# EAGLE design PowerConversionBoard (EAGLE 9.6.2)
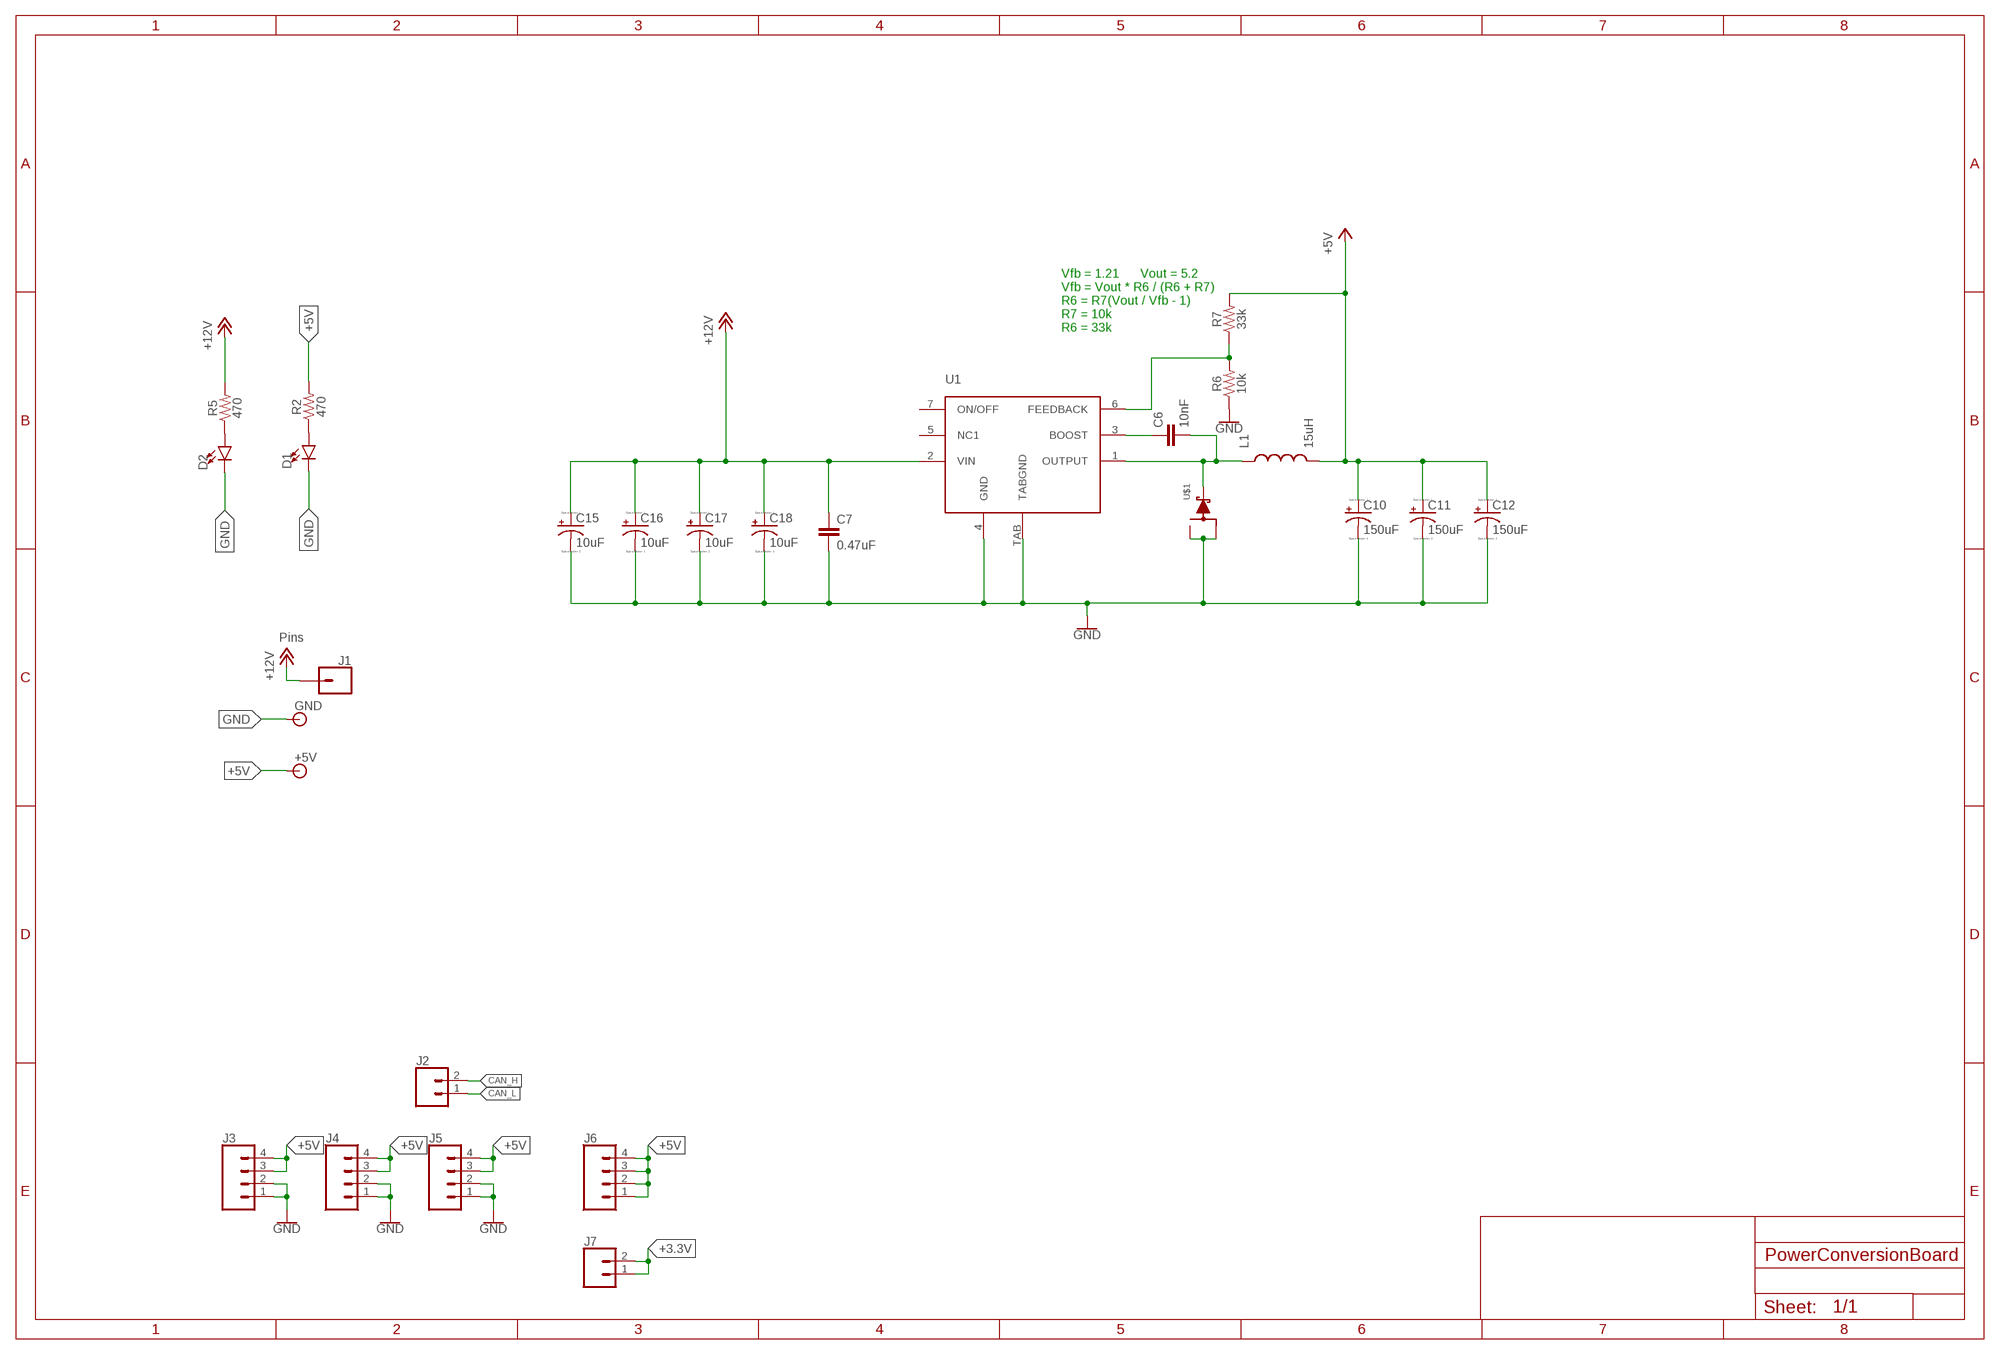
[diagram p0: schematic, sheet 1, part 1 of 3]
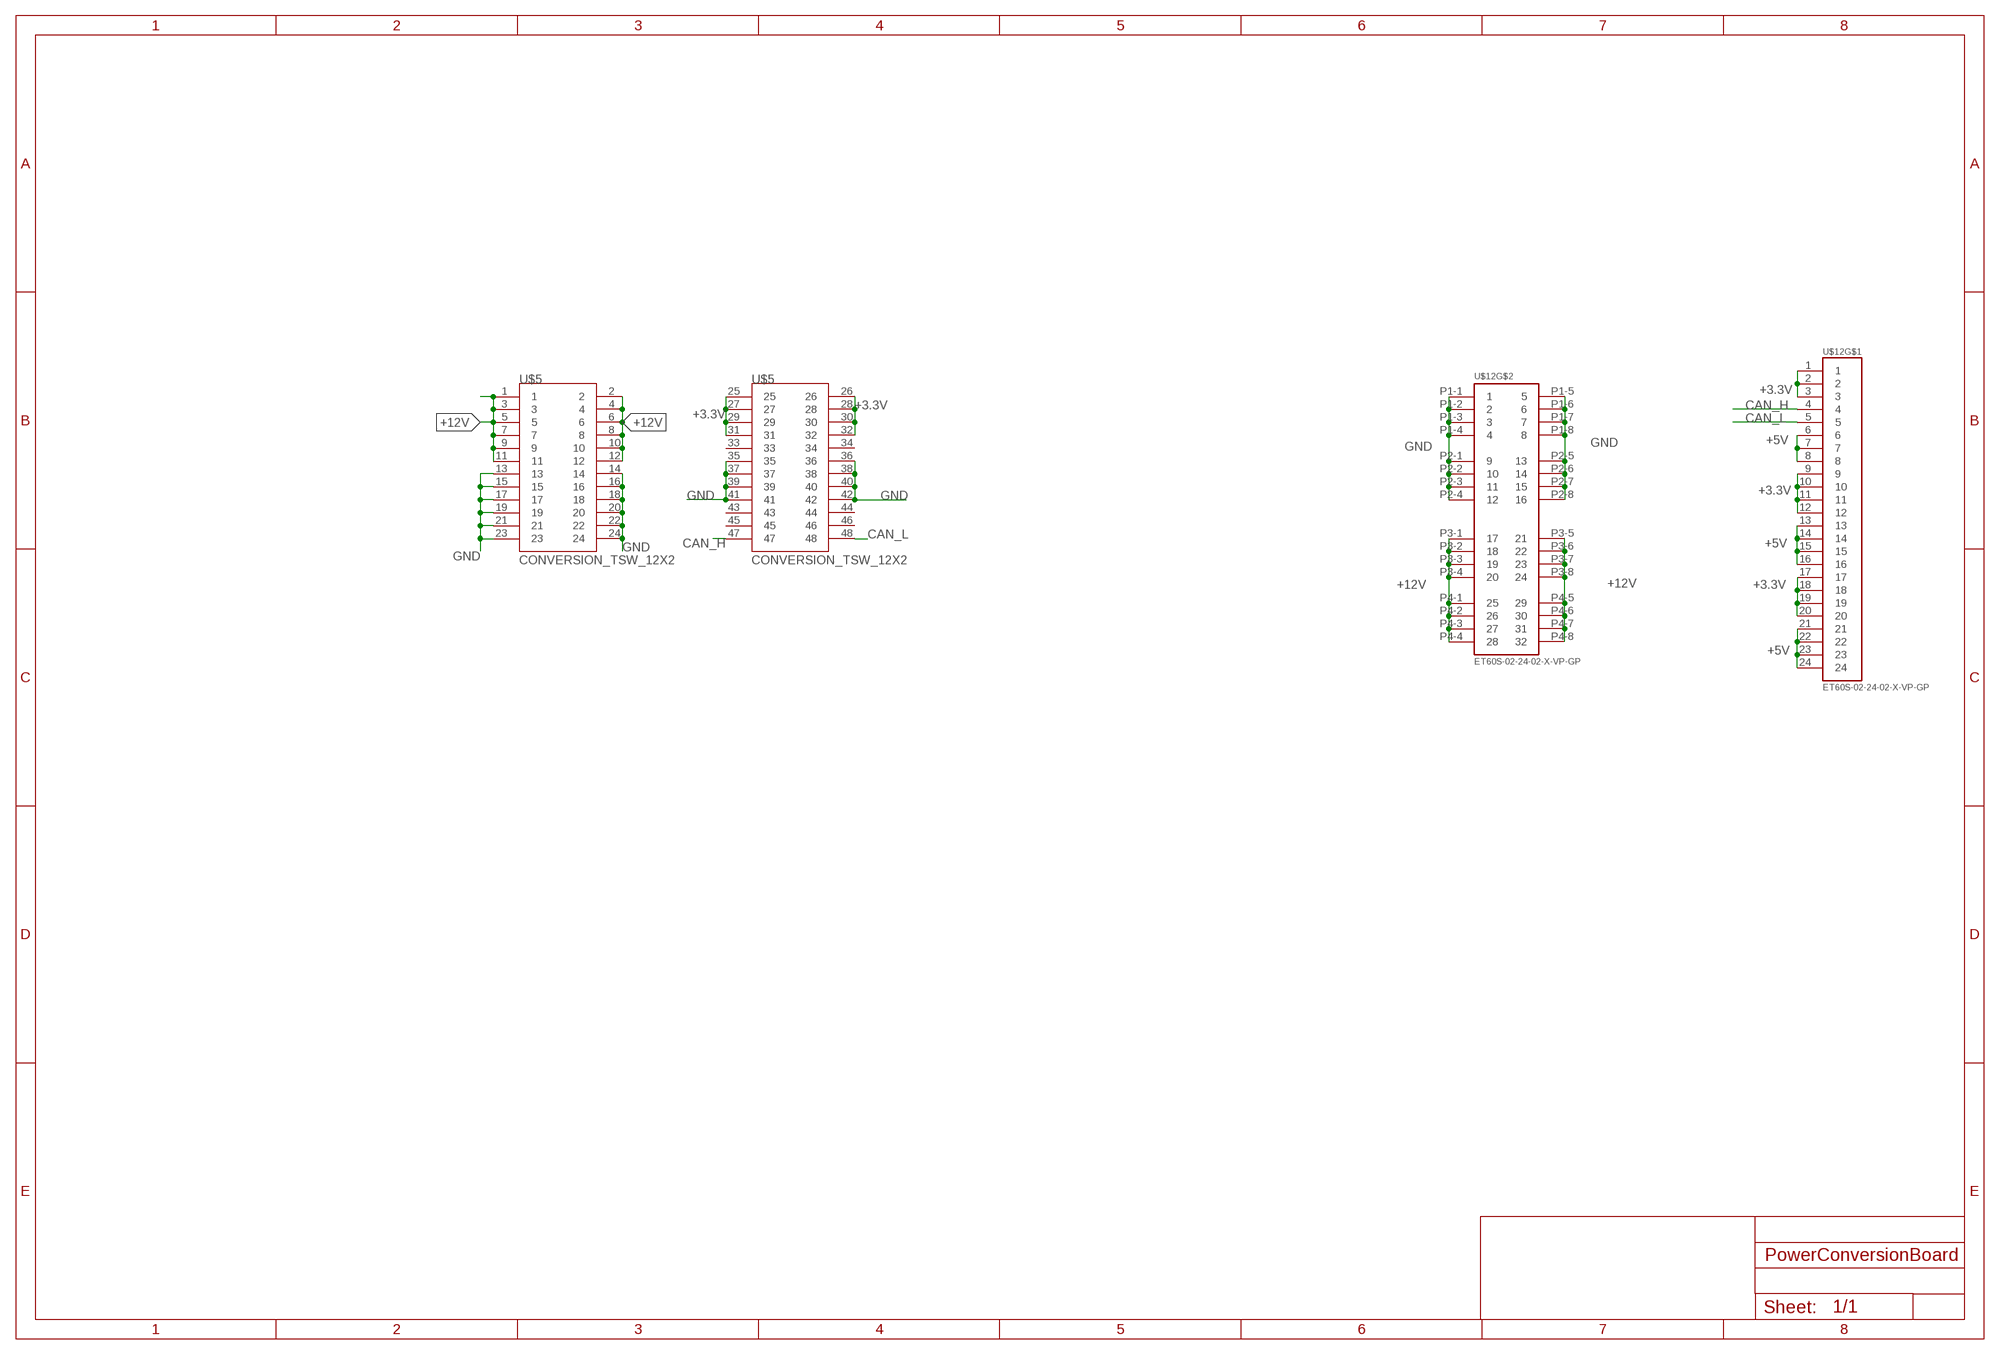
[diagram p1: schematic, sheet 1, part 2 of 3]
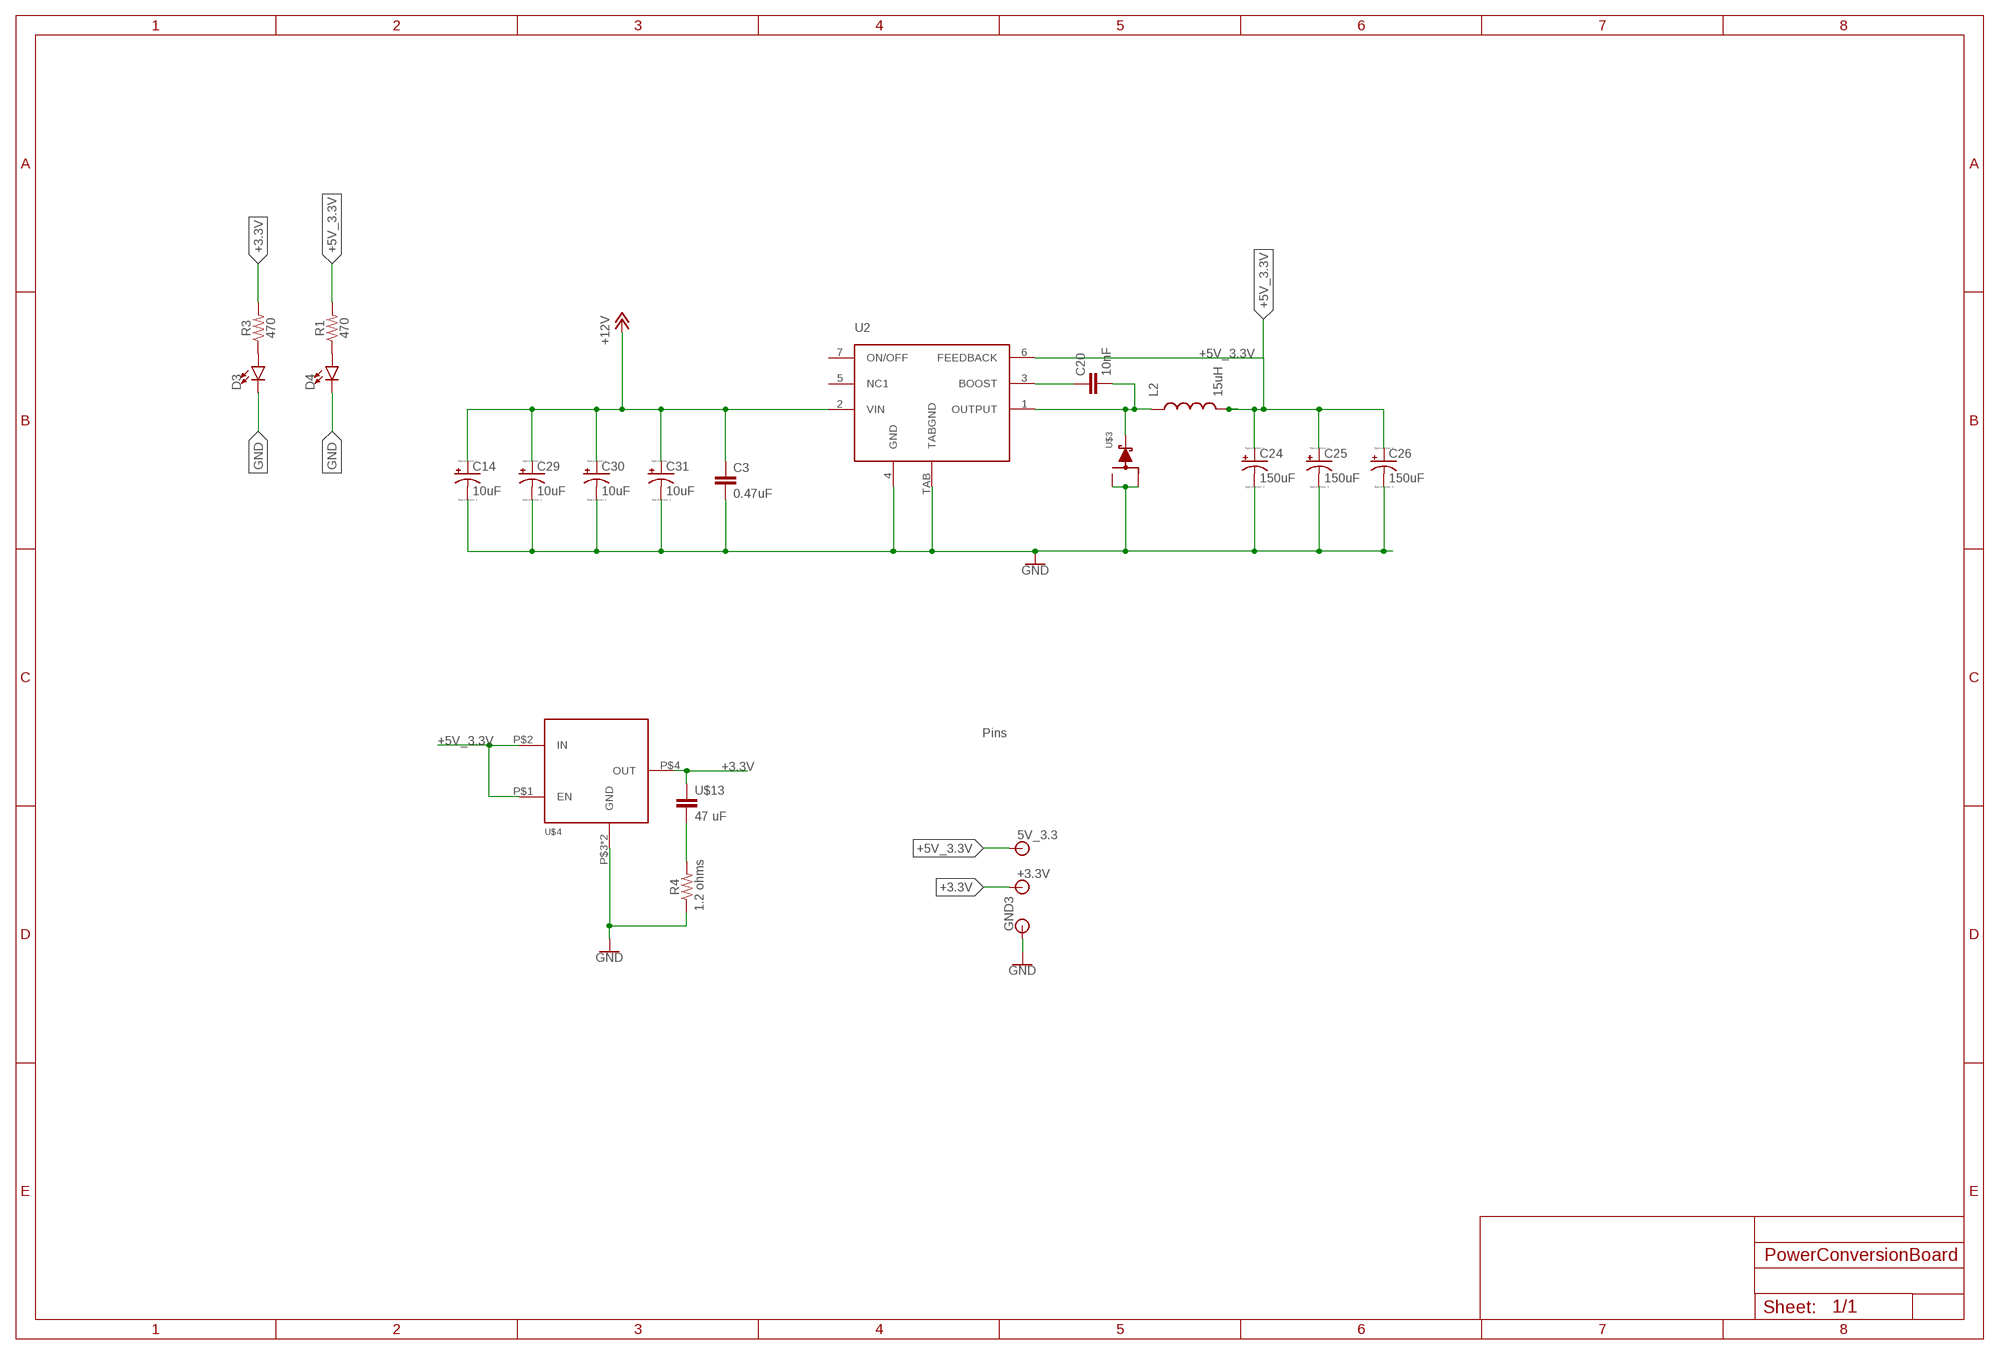
[diagram p2: schematic, sheet 1, part 3 of 3]

## Parts
5V_3.3  BANANA_CONN  [BANANA_CONN]
+3.3V  BANANA_CONN  [BANANA_CONN]
+5V  BANANA_CONN  [BANANA_CONN]
C3  0.47uF  C-EUC0603  [C0603]
C6  10nF  10NF-0603-50V-10%  [0603]
C7  0.47uF  C-EUC0603  [C0603]
C10  150uF  C-TANTALUM(10UF_150UF)  [CTAN(7.30_4.30MM)]
C11  150uF  C-TANTALUM(10UF_150UF)  [CTAN(7.30_4.30MM)]
C12  150uF  C-TANTALUM(10UF_150UF)  [CTAN(7.30_4.30MM)]
C14  10uF  C-TANTALUM(10UF_150UF)  [CTAN(7.30_4.30MM)]
C15  10uF  C-TANTALUM(10UF_150UF)  [CTAN(7.30_4.30MM)]
C16  10uF  C-TANTALUM(10UF_150UF)  [CTAN(7.30_4.30MM)]
C17  10uF  C-TANTALUM(10UF_150UF)  [CTAN(7.30_4.30MM)]
C18  10uF  C-TANTALUM(10UF_150UF)  [CTAN(7.30_4.30MM)]
C20  10nF  10NF-0603-50V-10%  [0603]
C24  150uF  C-TANTALUM(10UF_150UF)  [CTAN(7.30_4.30MM)]
C25  150uF  C-TANTALUM(10UF_150UF)  [CTAN(7.30_4.30MM)]
C26  150uF  C-TANTALUM(10UF_150UF)  [CTAN(7.30_4.30MM)]
C29  10uF  C-TANTALUM(10UF_150UF)  [CTAN(7.30_4.30MM)]
C30  10uF  C-TANTALUM(10UF_150UF)  [CTAN(7.30_4.30MM)]
C31  10uF  C-TANTALUM(10UF_150UF)  [CTAN(7.30_4.30MM)]
D1  LED0603  [LED-0603]
D2  LED0603  [LED-0603]
D3  LED0603  [LED-0603]
D4  LED0603  [LED-0603]
GND  BANANA_CONN  [BANANA_CONN]
GND3  BANANA_CONN  [BANANA_CONN]
J1  CONN_01  [1X01]
J2  CONN_02  [1X02]
J3  CONN_04  [1X04]
J4  CONN_04  [1X04]
J5  CONN_04  [1X04]
J6  CONN_04  [1X04]
J7  CONN_02  [1X02]
L1  15uH  HCMA1305  [HCMA1305]
L2  15uH  HCMA1305  [HCMA1305]
R1  470  470OHM-0603-1/10W-1%  [0603]
R2  470  470OHM-0603-1/10W-1%  [0603]
R3  470  470OHM-0603-1/10W-1%  [0603]
R4  1.2 ohms  RESISTOR0603  [0603]
R5  470  470OHM-0603-1/10W-1%  [0603]
R6  10k  10KOHM-0603-1/10W-1%  [0603]
R7  33k  33KOHM-0603-1/10W-1%  [0603]
U1  LM2678  [LM2678]
U2  LM2678  [LM2678]
U$1  SWITCHMODE_SCHOTTKY  [DPAK-3]
U$3  SWITCHMODE_SCHOTTKY  [DPAK-3]
U$4  TO-263  [TO-263]
U$5  CONVERSION_TSW_12X2  [CONVERSION_TSW_12X2]
U$12  ET60S-02-24-02-X-VP-GP  [ET60S-02-24-02-X-VP-GP]
U$13  47 uF  CAPACITOR_0603_N  [RESC0603_N]

## Nets
+3.3V: +3.3V.P$1 J7.1 J7.2 R3.2 U$4.P$4(OUT) U$5.25 U$5.26 U$5.27 U$5.28 U$5.29 U$5.30 U$5.31 U$5.32 U$12.1 U$12.2 U$12.3 U$12.9 U$12.10 U$12.11 U$12.12 U$12.17 U$12.18 U$12.19 U$12.20 U$13.1
+5V: +5V.P$1 C10.+ C11.+ C12.+ J3.3 J3.4 J4.3 J4.4 J5.3 J5.4 J6.1 J6.2 J6.3 J6.4 L1.2 R2.2 R7.2 U$12.6 U$12.7 U$12.8 U$12.13 U$12.14 U$12.15 U$12.16 U$12.21 U$12.22 U$12.23 U$12.24
+5V_3.3V: 5V_3.3.P$1 C24.+ C25.+ C26.+ L2.2 R1.2 U2.6(FEEDBACK) U$4.P$1(EN) U$4.P$2(IN)
+12V: C3.1 C7.1 C14.+ C15.+ C16.+ C17.+ C18.+ C29.+ C30.+ C31.+ J1.1 R5.2 U1.2(VIN) U2.2(VIN) U$5.1 U$5.2 U$5.3 U$5.4 U$5.5 U$5.6 U$5.7 U$5.8 U$5.9 U$5.10 U$5.11 U$5.12 U$12.P3-1 U$12.P3-2 U$12.P3-3 U$12.P3-4 U$12.P3-5 U$12.P3-6 U$12.P3-7 U$12.P3-8 U$12.P4-1 U$12.P4-2 U$12.P4-3 U$12.P4-4 U$12.P4-5 U$12.P4-6 U$12.P4-7 U$12.P4-8
BST: C6.1 U1.3(BOOST)
BST_5_3: C20.1 U2.3(BOOST)
CAN_H: J2.2 U$5.47 U$12.4
CAN_L: J2.1 U$5.48 U$12.5
FB: R6.2 R7.1 U1.6(FEEDBACK)
GND: C3.2 C7.2 C10.- C11.- C12.- C14.- C15.- C16.- C17.- C18.- C24.- C25.- C26.- C29.- C30.- C31.- D1.C D2.C D3.C D4.C GND3.P$1 GND.P$1 J3.1 J3.2 J4.1 J4.2 J5.1 J5.2 R4.1 R6.1 U1.4(GND) U1.TAB(TABGND) U2.4(GND) U2.TAB(TABGND) U$1.P$1 U$1.P$3 U$3.P$1 U$3.P$3 U$4.P$3(GND) U$4.P$6(GND) U$5.13 U$5.14 U$5.15 U$5.16 U$5.17 U$5.18 U$5.19 U$5.20 U$5.21 U$5.22 U$5.23 U$5.24 U$5.35 U$5.36 U$5.37 U$5.38 U$5.39 U$5.40 U$5.41 U$5.42 U$12.P1-1 U$12.P1-2 U$12.P1-3 U$12.P1-4 U$12.P1-5 U$12.P1-6 U$12.P1-7 U$12.P1-8 U$12.P2-1 U$12.P2-2 U$12.P2-3 U$12.P2-4 U$12.P2-5 U$12.P2-6 U$12.P2-7 U$12.P2-8
N$4: D2.A R5.1
N$5: D3.A R3.1
N$6: D4.A R1.1
N$8: D1.A R2.1
N$10: R4.2 U$13.2
SW_5: C6.2 L1.1 U1.1(OUTPUT) U$1.P$4
SW_5_3: C20.2 L2.1 U2.1(OUTPUT) U$3.P$4
Unconnected: U1.5(NC1) U1.7(ON/OFF) U2.5(NC1) U2.7(ON/OFF) U$5.33 U$5.34 U$5.43 U$5.44 U$5.45 U$5.46

## Notes on the sheet
- Vfb = 1.21      Vout = 5.2
  Vfb = Vout * R6 / (R6 + R7)
  R6 = R7(Vout / Vfb - 1)
  R7 = 10k
  R6 = 33k
- Pins
- Pins

## Library data of the parts
5V_3.3 +3.3V +5V GND GND3 = SparkFun-Connectors:BANANA_CONN: Through-hole Banana Jack Basic PTH connection for banana jack plugs SparkFun Products: Multimeter Kit <https://www.sparkfun.com/products/retired/10956> Banana to Alligator Cable <https://www.sparkfun.com/products/retired/509> Banana to Alligator Coax Cable <https://www.sparkfun.com/products/retired/508> Banana to Banana Cable <https://www.sparkfun.com/products/retired/507> Banana to IC Hook Cables <https://www.sparkfun.com/products/retired/506>
C3 C7 = rcl:C-EU: CAPACITOR, European symbol; SPICEPREFIX: C
C6 C20 = SparkFun-Capacitors:10NF: 0.01uF/10nF/10,000pF ceramic capacitors A capacitor is a passive two-terminal electrical component used to store electrical energy temporarily in an electric field. CAP-09321; PROD_ID: CAP-00867
C10-C12 C14-C18 C24-C26 C29-C31 = PowerComponents:C-TANTALUM(10UF_150UF)
D1-D4 = SparkFun-LED:LED: LED (Generic) Standard schematic elements and footprints for 5mm, 3mm, 1206, and 0603 sized LEDs. Generic LEDs with no color specified.
J1 = SparkFun-Connectors:CONN_01: Single connection point. Often used as Generic Header-pin footprint for 0.1 inch spaced/style header connections On any of the 0.1 inch spaced packages, you can populate with these: Break Away Headers - Straight <https://www.sparkfun.com/products/116> (PRT-00116) Break Away Male Headers - Right Angle <https://www.sparkfun.com/products/553> (PRT-00553) Female Headers <https://www.sparkfun.com/products/115> (PRT-00115) Break Away Headers - Machine Pin <https://www.sparkfun.com/products/117> (PRT-00117) Break Away Female Headers - Swiss Machine Pin <https://www.sparkfun.com/products/743> (PRT-00743) This device is also useful as a general connection point to wire up your design to another part of your project. Our various solder wires solder well into these plated through hole pads. Hook-Up Wire - Assortment (Stranded, 22 AWG) <https://www.sparkfun.com/products/11375> (PRT-11375) Hook-Up Wire - Assortment (Solid Core, 22 AWG) <https://www.sparkfun.com/products/11367> (PRT-11367) View the entire wire category on our website here <https://www.sparkfun.com/categories/141> Special notes: SMTSO-256-ET is a "flush mount" nut for a 4-40 screw. We mostly use this on specialty testbeds; it is a nice way to connect hardware to your PCB at an adjustable hieght. Also note, the SNAP packages are for using a snappable style connector. We sell a baggie of snaps and they are also used on two LilyPad designs: Snap Assortment - 30 pack (male and female) <https://www.sparkfun.com/products/11347> (DEV-11347) LilyPad Arduino SimpleSnap <https://www.sparkfun.com/products/10941> (DEV-10941) LilyPad SimpleSnap Protoboard <https://www.sparkfun.com/products/10940> (DEV-10940)
J2 J7 = SparkFun-Connectors:CONN_02: Multi connection point. Often used as Generic Header-pin footprint for 0.1 inch spaced/style header connections On any of the 0.1 inch spaced packages, you can populate with these: Break Away Headers - Straight <https://www.sparkfun.com/products/116> (PRT-00116) Break Away Male Headers - Right Angle <https://www.sparkfun.com/products/553> (PRT-00553) Female Headers <https://www.sparkfun.com/products/115> (PRT-00115) Break Away Headers - Machine Pin <https://www.sparkfun.com/products/117> (PRT-00117) Break Away Female Headers - Swiss Machine Pin <https://www.sparkfun.com/products/743> (PRT-00743) For SCREWTERMINALS and SPRING TERMINALS visit here: Screw Terimnals on SparkFun.com <https://www.sparkfun.com/search/results?term=Screw+Terminals> (5mm/3.5mm/2.54mm spacing) This device is also useful as a general connection point to wire up your design to another part of your project. Our various solder wires solder well into these plated through hole pads. Hook-Up Wire - Assortment (Stranded, 22 AWG) <https://www.sparkfun.com/products/11375> (PRT-11375) Hook-Up Wire - Assortment (Solid Core, 22 AWG) <https://www.sparkfun.com/products/11367> (PRT-11367) View the entire wire category on our website here <https://www.sparkfun.com/categories/141> Special notes: Molex polarized connector foot print use with: PRT-08233 with associated crimp pins and housings. 2.54_SCREWTERM for use with PRT-10571. 3.5mm Screw Terminal footprints for PRT-08084 5mm Screw Terminal footprints for use with PRT-08432
J3-J6 = SparkFun-Connectors:CONN_04: Multi connection point. Often used as Generic Header-pin footprint for 0.1 inch spaced/style header connections On any of the 0.1 inch spaced packages, you can populate with these: Break Away Headers - Straight <https://www.sparkfun.com/products/116> (PRT-00116) Break Away Male Headers - Right Angle <https://www.sparkfun.com/products/553> (PRT-00553) Female Headers <https://www.sparkfun.com/products/115> (PRT-00115) Break Away Headers - Machine Pin <https://www.sparkfun.com/products/117> (PRT-00117) Break Away Female Headers - Swiss Machine Pin <https://www.sparkfun.com/products/743> (PRT-00743) For SCREWTERMINALS and SPRING TERMINALS visit here: Screw Terimnals on SparkFun.com <https://www.sparkfun.com/search/results?term=Screw+Terminals> (5mm/3.5mm/2.54mm spacing) This device is also useful as a general connection point to wire up your design to another part of your project. Our various solder wires solder well into these plated through hole pads. Hook-Up Wire - Assortment (Stranded, 22 AWG) <https://www.sparkfun.com/products/11375> (PRT-11375) Hook-Up Wire - Assortment (Solid Core, 22 AWG) <https://www.sparkfun.com/products/11367> (PRT-11367) View the entire wire category on our website here <https://www.sparkfun.com/categories/141> Special notes: Molex polarized connector foot print use with SKU : PRT-08231 with associated crimp pins and housings. 1MM SMD Version SKU: PRT-10208; PROD_ID: CONN-09696
L1 L2 = Inductor_15uH - hcma1305:HCMA1305: Eaton HCMA1305-150-R Inductor
R1-R3 R5 = SparkFun-Resistors:470OHM: 470Ω resistor A resistor is a passive two-terminal electrical component that implements electrical resistance as a circuit element. Resistors act to reduce current flow, and, at the same time, act to lower voltage levels within circuits. - Wikipedia; PROD_ID: RES-07869
R4 = SparkFun-Resistors:RESISTOR: Generic Resistor Package
R6 = SparkFun-Resistors:10KOHM: 10kΩ resistor A resistor is a passive two-terminal electrical component that implements electrical resistance as a circuit element. Resistors act to reduce current flow, and, at the same time, act to lower voltage levels within circuits. - Wikipedia; PROD_ID: RES-00824
R7 = SparkFun-Resistors:33KOHM: 33kΩ resistor A resistor is a passive two-terminal electrical component that implements electrical resistance as a circuit element. Resistors act to reduce current flow, and, at the same time, act to lower voltage levels within circuits. - Wikipedia; PROD_ID: RES-08416
U1 U2 = PowerComponents:LM2678: LM2678 Buck Converter IC 12V-to-5V
U$1 U$3 = PowerComponents:SWITCHMODE_SCHOTTKY: {Digi-Key Part Number: MBRD835LT4GOSCT-ND} {Voltage - DC Reverse (Vr) (Max): 35V} {Current - Average Rectified (Io): 8A} {Voltage - Forward (Vf) (Max) @ If: 510mV @ 8A} {Speed: Fast Recovery =< 500ns, > 200mA (Io)} {Current - Reverse Leakage @ Vr: 1.4mA @ 35V} {Mounting Type: Surface Mount} {Package / Case: TO-252-3, DPak (2 Leads + Tab), SC-63} {Supplier Device Package: DPAK-3} {Operating Temperature - Junction: -65°C ~ 150°C}
U$4 = TPS758:TO-263
U$5 = Dist_to_Conversion_Connector:CONVERSION_TSW_12X2
U$12 = ET60S-02-24-02-X-VP-GP:ET60S-02-24-02-X-VP-GP: VERTICAL SOCKET ET60 POWER ASSEM.
U$13 = Nordic_nRF:CAPACITOR: Generic chip capacitor

## Board
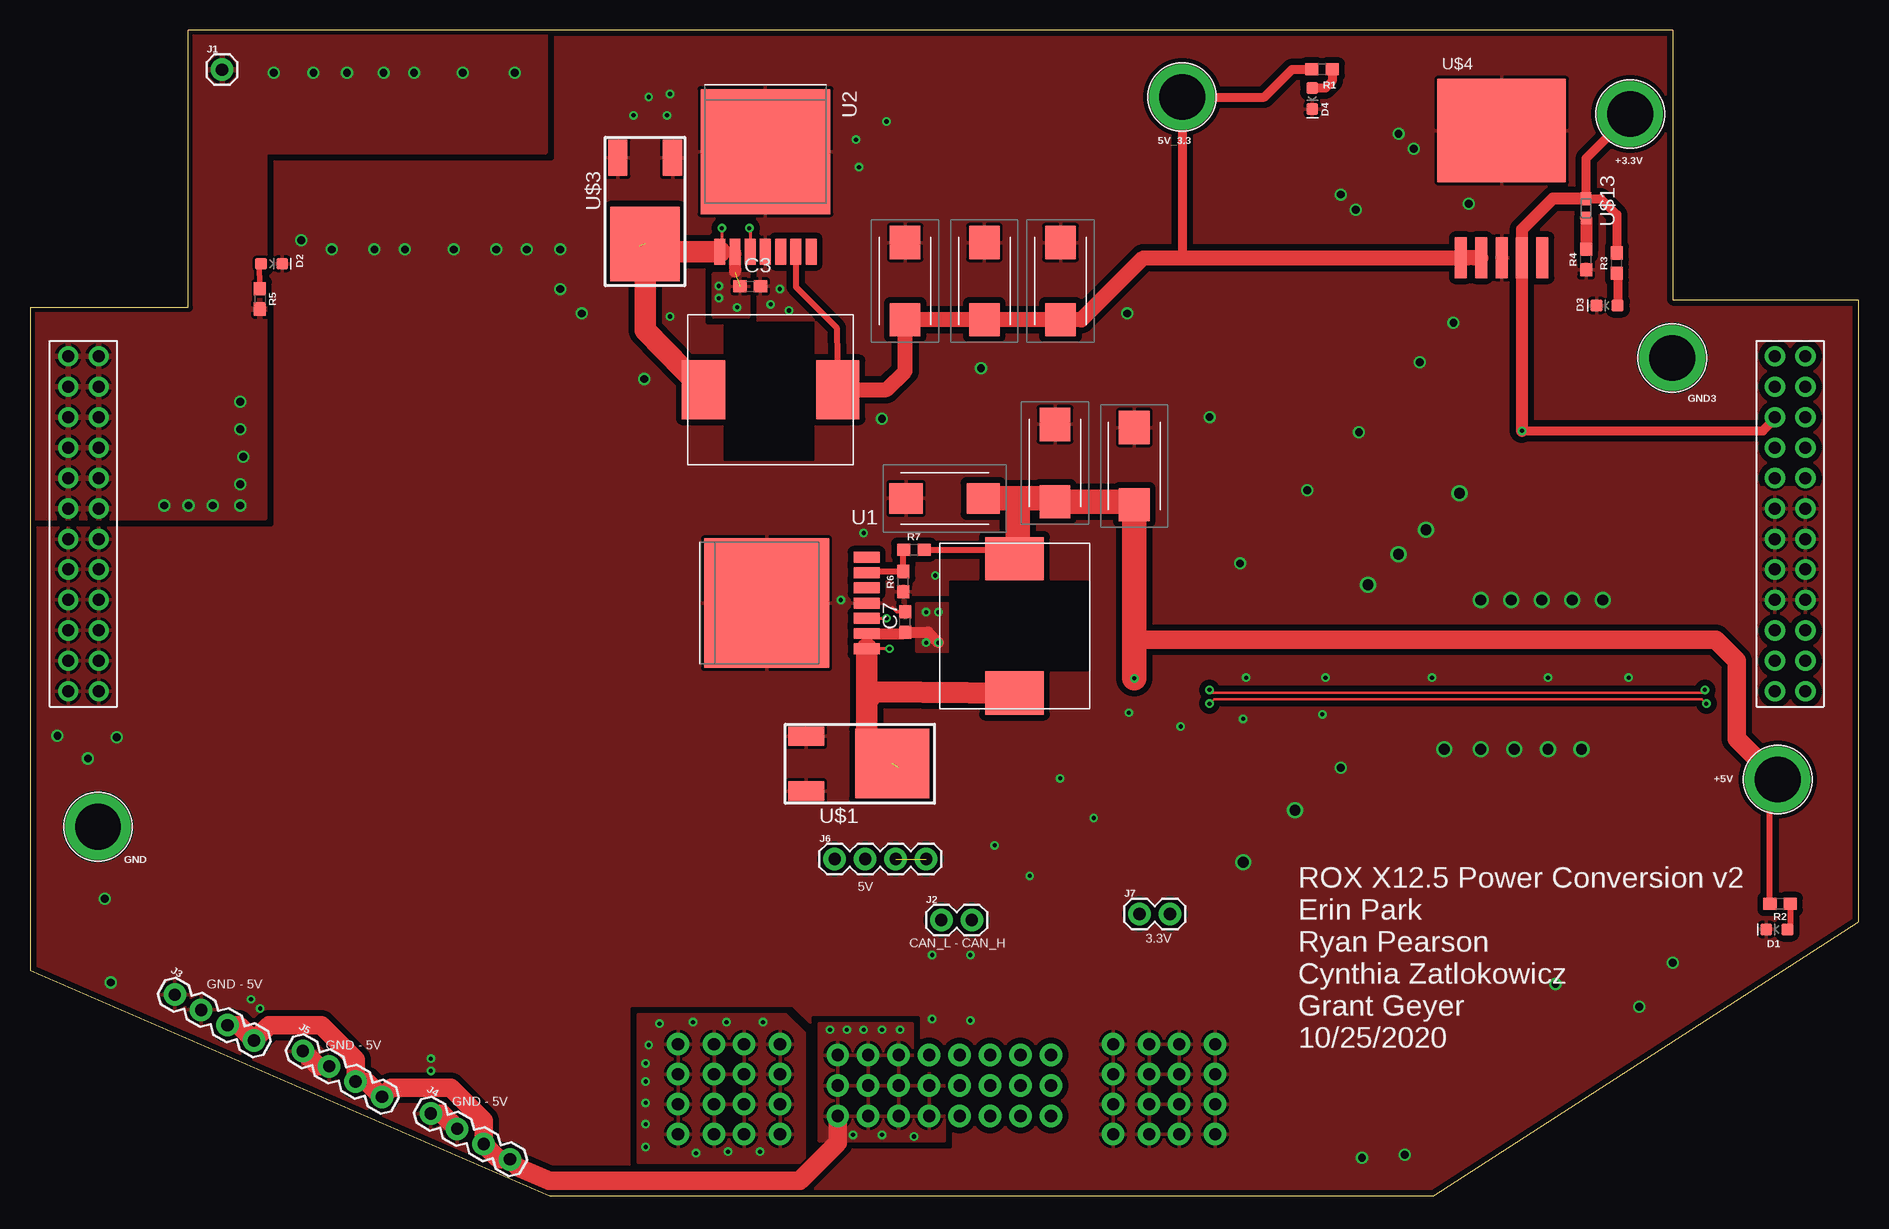
[diagram p3: board, top side]
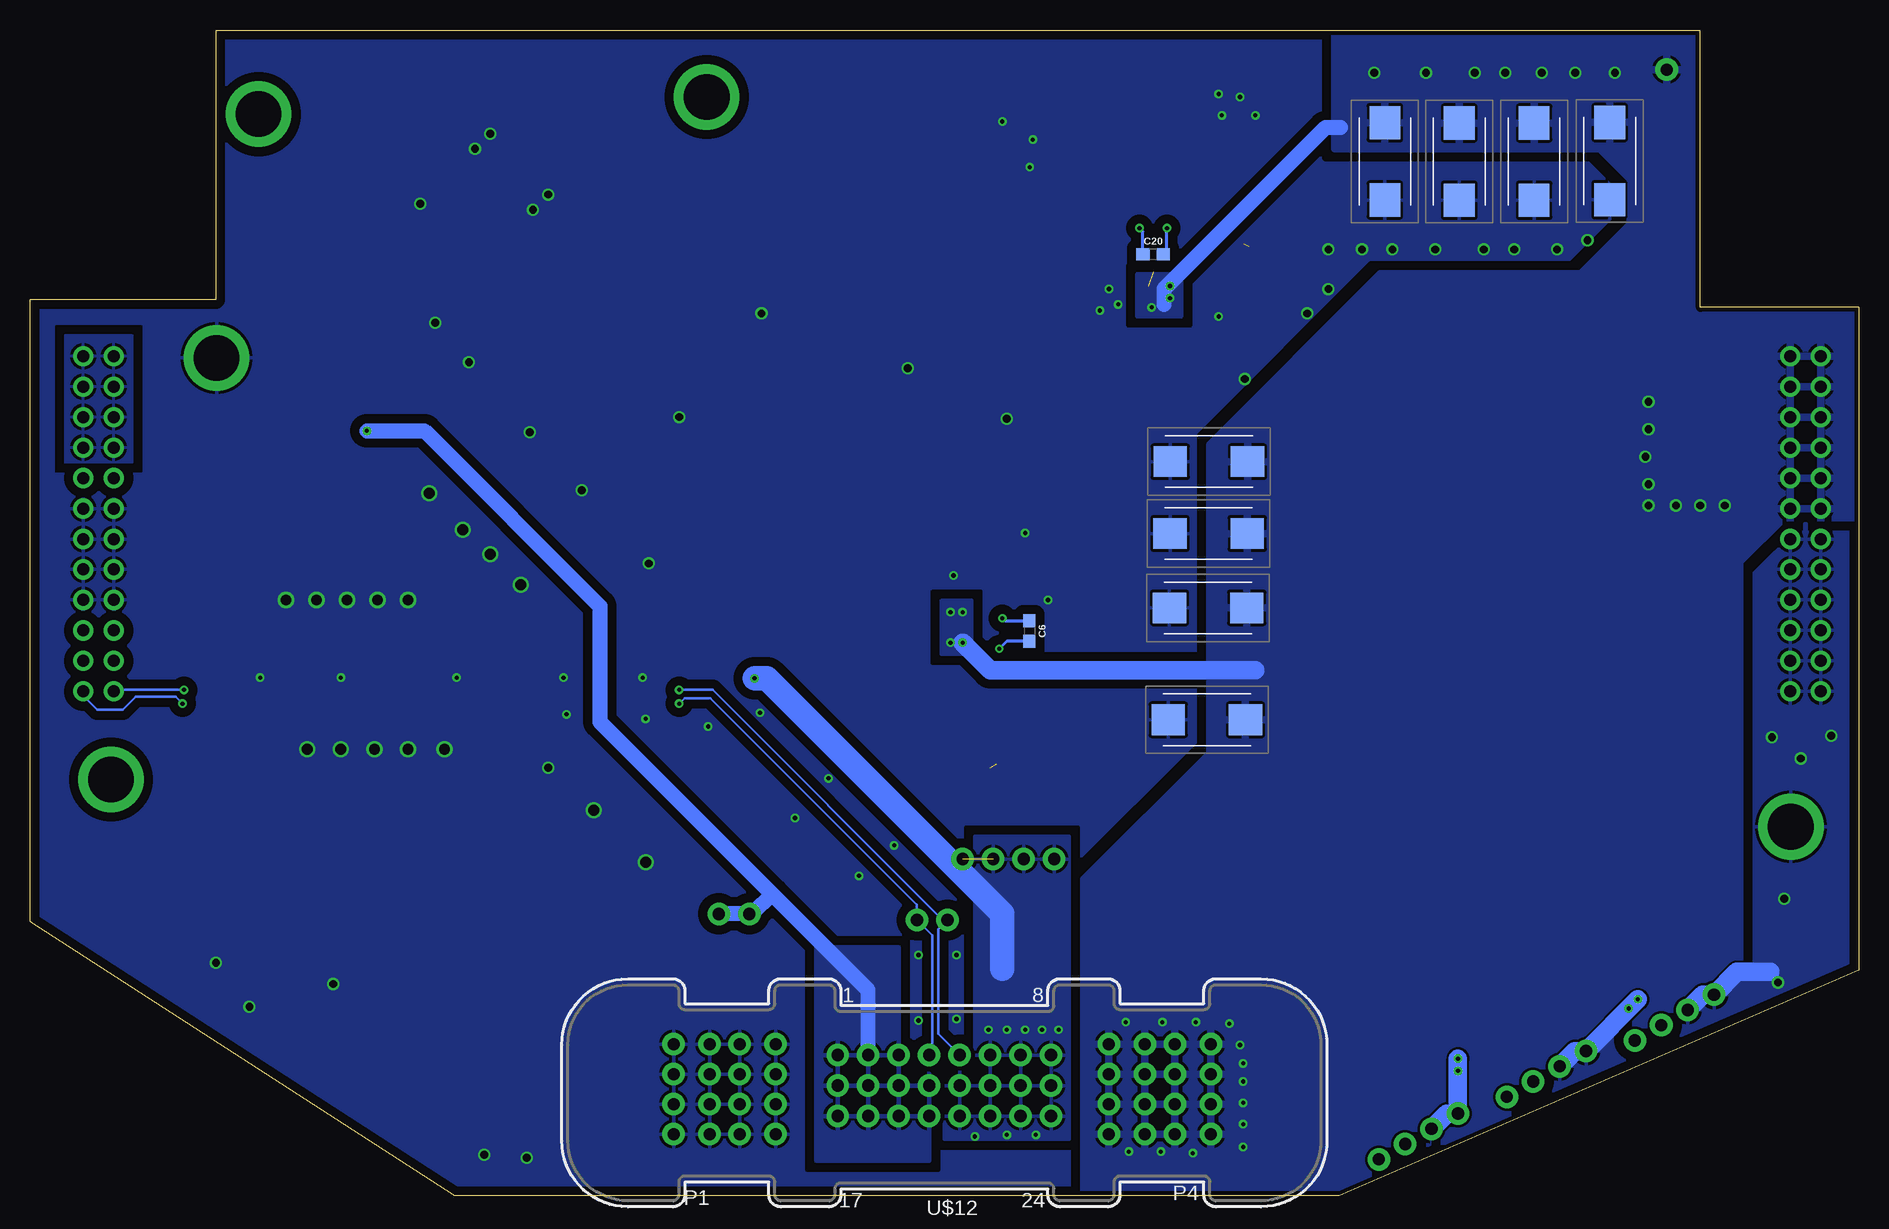
[diagram p4: board, bottom side, seen from below]

Size 152.4 x 97.16 mm. Coordinates in mm from the lower left corner, seen from the top.
Outline: 0,74.04 0,18.8 43.31,0 116.98,0 152.4,22.84 152.4,74.68 136.91,74.68 136.91,97.16 13.21,97.16 13.21,74.04 0,74.04
Copper layers (1*16): Top 0.0356mm / dielectric 1.5011mm / Bottom 0.0356mm
Design rules "ECE_Senior_Design (1)": minimum track width 8mil, minimum drill 13mil, track to track 8mil, track to pad 8mil, pad to pad 6mil, via to via 8mil, smd to smd 6mil, copper to edge 15mil, drill to drill 8mil, minimum pad ring 7mil, minimum via ring 7mil, stop-mask expansion 3mil, vias tented up to drill 0mil, thermal gap 10mil

### Footprints (pad centres in the part's own frame; a part is rotated, then mirrored left to right if it is on the bottom)
BANANA_CONN = drill 3.81 pad 5.461: P$1 0,0
C0603 = smd 1.1 x 1: 1 -0.85,0; 2 0.85,0
0603 = smd 1.1 x 1: 1 -0.85,0; 2 0.85,0
CTAN(7.30_4.30MM) = smd 2.77 x 2.55: + -3.22,0; - 3.22,0
LED-0603 = smd 1 x 1: A -0.877,0; C 0.877,0
1X01 = drill 1.016 pad 1.88: 1 0,0
1X02 = drill 1.016 pad 1.88: 1 0,0; 2 2.54,0
1X04 = drill 1.016 pad 1.88: 1 0,0; 2 2.54,0; 3 5.08,0; 4 7.62,0
HCMA1305 = smd 3.6 x 4.9: 1 -5.6,0; 2 5.6,0
LM2678 = smd 2.159 x 0.914: 1 8.331,-3.81; 2 8.331,-2.54; 3 8.331,-1.27; 4 8.331,0; 5 8.331,1.27; 6 8.331,2.54; 7 8.331,3.81 | smd 10.414 x 10.795: TAB 0,0
DPAK-3 = smd 3 x 1.6: P$1 4.08,-2.285; P$3 4.08,2.285 | smd 6.2 x 5.8: P$4 -3.1,0
TO-263 = smd 1 x 3.4: P$1 -3.4,-10.7; P$2 -1.7,-10.7; P$3 0,-10.7; P$4 1.7,-10.7; P$5 3.4,-10.7 | smd 10.7 x 8.6: P$6 0,-0.1
CONVERSION_TSW_12X2 = drill 1 pad 1.676: 1 0,2.54; 2 0,0; 3 2.54,2.54; 4 2.54,0; 5 5.08,2.54; 6 5.08,0; 7 7.62,2.54; 8 7.62,0; 9 10.16,2.54; 10 10.16,0; 11 12.7,2.54; 12 12.7,0; 13 15.24,2.54; 14 15.24,0; 15 17.78,2.54; 16 17.78,0; 17 20.32,2.54; 18 20.32,0; 19 22.86,2.54; 20 22.86,0; 21 25.4,2.54; 22 25.4,0; 23 27.94,2.54; 24 27.94,0; 25 0,144.78; 26 0,142.24; 27 2.54,144.78; 28 2.54,142.24; 29 5.08,144.78; 30 5.08,142.24; 31 7.62,144.78; 32 7.62,142.24; 33 10.16,144.78; 34 10.16,142.24; 35 12.7,144.78; 36 12.7,142.24; 37 15.24,144.78; 38 15.24,142.24; 39 17.78,144.78; 40 17.78,142.24; 41 20.32,144.78; 42 20.32,142.24; 43 22.86,144.78; 44 22.86,142.24; 45 25.4,144.78; 46 25.4,142.24; 47 27.94,144.78; 48 27.94,142.24
ET60S-02-24-02-X-VP-GP = drill 1.02 pad 1.87: 1 8.89,-2.84; 2 6.35,-2.84; 3 3.81,-2.84; 4 1.27,-2.84; 5 -1.27,-2.84; 6 -3.81,-2.84; 7 -6.35,-2.84; 8 -8.89,-2.84; 9 8.89,-0.3; 10 6.35,-0.3; 11 3.81,-0.3; 12 1.27,-0.3; 13 -1.27,-0.3; 14 -3.81,-0.3; 15 -6.35,-0.3; 16 -8.89,-0.3; 17 8.89,2.24; 18 6.35,2.24; 19 3.81,2.24; 20 1.27,2.24; 21 -1.27,2.24; 22 -3.81,2.24; 23 -6.35,2.24; 24 -8.89,2.24; P1-1 22.56,-3.75; P1-2 22.56,-1.25; P1-3 22.56,1.25; P1-4 22.56,3.75; P1-5 19.56,-3.75; P1-6 19.56,-1.25; P1-7 19.56,1.25; P1-8 19.56,3.75; P2-1 17.06,-3.75; P2-2 17.06,-1.25; P2-3 17.06,1.25; P2-4 17.06,3.75; P2-5 14.06,-3.75; P2-6 14.06,-1.25; P2-7 14.06,1.25; P2-8 14.06,3.75; P3-1 -13.7,-3.75; P3-2 -13.7,-1.25; P3-3 -13.7,1.25; P3-4 -13.7,3.75; P3-5 -16.7,-3.75; P3-6 -16.7,-1.25; P3-7 -16.7,1.25; P3-8 -16.7,3.75; P4-1 -19.2,-3.75; P4-2 -19.2,-1.25; P4-3 -19.2,1.25; P4-4 -19.2,3.75; P4-5 -22.2,-3.75; P4-6 -22.2,-1.25; P4-7 -22.2,1.25; P4-8 -22.2,3.75
RESC0603_N = smd 1.05 x 0.9: 1 -0.8,0; 2 0.8,0

### Placement (x,y rotation side)
5V_3.3  96.01,91.57 0 top
+3.3V  133.35,90.14 0 top
+5V  145.64,34.7 0 top
C3  60.02,75.79 0 top
C6  69.11,47.07 270 bottom
C7  72.92,47.83 90 top
C10  85.42,61.06 90 top
C11  76.23,58.12 180 top
C12  92.02,60.81 90 top
C14  33.3,86.18 270 bottom
C15  54.15,61.19 180 bottom
C16  54.33,39.67 180 bottom
C17  54.23,49 180 bottom
C18  54.18,55.19 180 bottom
C20  58.8,78.49 0 bottom
C24  79.53,76.23 90 top
C25  72.92,76.23 90 top
C26  85.88,76.23 90 top
C29  39.5,86.21 270 bottom
C30  27.05,86.18 270 bottom
C31  20.75,86.23 270 bottom
D1  145.57,22.2 180 top
D2  20.14,77.67 0 top
D3  131.42,74.19 180 top
D4  106.86,91.44 270 top
GND  5.66,30.76 0 top
GND3  136.86,69.82 0 top
J1  16,93.85 0 top
J2  75.95,22.99 0 top
J3  12.06,16.76 330 top
J4  33.4,6.86 330 top
J5  22.73,12.07 330 top
J6  67.06,28.07 0 top
J7  92.46,23.5 0 top
L1  82.04,47.5 90 top
L2  61.72,67.18 0 top
R1  107.67,93.88 180 top
R2  145.85,24.33 180 top
R3  132.23,77.72 90 top
R4  129.67,78.03 90 top
R5  19.15,74.75 270 top
R6  72.77,51.18 90 top
R7  73.66,53.85 0 top
U1  61.39,49.4 0 top
U2  61.29,87.02 270 top
U$1  68.76,36.02 180 top
U$3  51.26,82.42 90 top
U$4  122.63,88.87 0 top
U$5  3.17,69.98 270 top
U$12  76.2,8.89 180 bottom
U$13  129.67,82.3 270 top

### Tracks (layer width: path | path; a pad name or v marks a point on that pad's centre or on a via)
+3.3V  (via drill 0.35)
  Top 0.762: +3.3V.P$1 129.67,86.46 U$13.1 130.9,83.1 132.23,81.76 R3.2 | v124.33,63.75 144.4,63.75 145.41,64.77 U$5.30
  Top 1.016: U$13.1 126.91,83.1 124.33,80.52 U$4.P$4 v124.33,63.76 v124.33,63.75
  Bottom 1.27: v124.33,63.75 119.51,63.75 104.9,49.15 104.9,39.5 90.55,25.15 | 90.55,25.15 82.55,17.14 U$12.2 | 90.55,25.15 92.2,23.5 J7.1 J7.2
  pour Bottom: 143.89,71.75 143.89,61.09 149.48,61.09 149.48,71.75
  pour Bottom: 86.87,20.7 86.87,2.92 77.47,2.92 77.47,10.16 80.01,10.16 80.01,20.7
+5V  (via drill 0.35)  (1 unrouted)
  Top 0.508: +5V.P$1 145,34.05 R2.2 | R7.2 81.7,53.85 82.3,53.25
  Top 1.016: J5.3 28.06,9.53
  Top 1.524: +5V.P$1 142.24,38.1 142.24,44.58 140.46,46.35 92.02,46.35 | J3.3 17.39,14.22 J3.4 19.93,14.22 24.26,14.22 27.13,11.35 J5.3 | 28.06,9.53 J5.4 30.09,9.02 35.05,9.02 37.21,6.86 37.24,6.84 37.24,6.83 37.8,6.27 J4.3 39.01,3.11 39.16,3.05 J4.4 40.65,2.4 43.25,1.27 64.14,1.27 67.31,4.45 U$12.24
  Top 2.032: C11.+ 82.3,58.12 | 82.3,58.12 85.15,58.12 C10.+ 91.77,57.84 C12.+ 92.02,46.35 v92.02,43.13 | 82.3,58.12 82.3,53.25 L1.2
  Bottom 2.032: v92.02,43.13 91.01,43.13 71.37,23.5 71.37,18.92
  other vias: 66.67,13.84 68.07,13.84 69.47,13.84 70.99,13.84 72.52,13.84 68.58,5.08 70.99,5.08 73.66,4.95
  pour Bottom (isolate 0.305, rank 2): 65.79,29.97 73.66,29.97 73.66,10.29 76.2,10.29 76.2,4.7 65.79,4.7
  pour Top: 65.79,14.35 73.53,14.35 73.53,10.16 76.2,10.16 76.2,4.57 65.79,4.57
+5V_3.3V
  Top 0.508: U2.6 63.83,75.74 67.22,72.35 L2.2
  Top 0.762: R1.2 105.18,93.88 102.87,91.57 5V_3.3.P$1 96.01,78.43 96.27,78.18
  Top 1.27: U$4.P$2 arc0 U$4.P$1 96.27,78.18 92.78,78.18 87.61,73 C26.+ C24.+ C25.+ 72.92,68.73 71.37,67.18 L2.2
+12V  (via drill 0.35, 0.65)  (1 unrouted)
  Top 0.914: U1.2 72.81,46.86 C7.1 74.81,46.98 v75.69,46.1
  Top 1.016: U2.2 arc0 58.75,77.01
  Bottom 1.27: 43.18,89.03 44.45,89.03 57.91,75.56 57.91,74.29
  Bottom 1.524: v74.68,46.1 72.39,43.81 50.29,43.81
  other vias: 57.4,75.82 57.4,74.8 58.93,74.04 74.68,48.64 75.69,48.64 17.53,57.53 15.24,57.53 13.21,57.53 11.18,57.53 17.53,59.31 17.78,61.6 17.53,63.88 17.53,66.17 40.39,93.6 36.07,93.6 32,93.6 29.46,93.6 26.42,93.6 23.62,93.6 20.32,93.6 55.5,3.56 58.17,3.68 60.83,3.68 51.31,4.06 51.31,5.97 51.31,7.75 51.31,9.53 51.31,11.05 51.56,12.57 52.45,14.35 55.24,14.48 58.04,14.48 61.09,14.48
  pour Bottom: 43.69,98.43 43.69,87.25 21.59,87.25 19.05,84.71 19.05,80.98 23.19,76.84 39.88,76.84 54.1,62.61 54.1,36.83 64.57,26.37 64.57,-1.68 64.31,-1.93 28.22,-1.93 9.91,16.38 9.91,52.83 6.22,56.52 -2.03,56.52 -3.3,57.78 -3.3,98.43 -1.27,100.46 41.66,100.46
  pour Top: 59.94,73.28 59.94,76.84 56.9,76.84 56.9,73.28
  pour Bottom: 56.39,73.28 56.39,76.84 60.2,76.84 60.2,73.28
  pour Top: 73.91,49.4 76.45,49.4 76.45,45.34 73.91,45.34
  pour Bottom: 76.45,49.66 73.91,49.66 73.91,45.09 76.45,45.09
  pour Top: -0.51,56.52 19.56,56.52 19.56,76.84 19.56,87 42.93,87 42.93,100.97 -1.78,100.97 -1.78,56.52
  pour Top: 50.67,15.11 62.99,15.11 64.52,13.59 64.52,2.79 50.67,2.79
BST  (via drill 0.35)
  Top 0.254: U1.3 v71.37,48.13
  Bottom 0.254: v71.37,48.13 71.16,47.92 C6.1
BST_5_3  (via drill 0.35)
  Top 0.254: v59.94,80.65 60.02,80.57 U2.3
  Bottom 0.254: C20.1 59.65,80.35 v59.94,80.65
CAN_H  (via drill 0.35)
  Top 0.203: v139.7,41.02 139.32,41.4 98.68,41.4 v98.3,41.02
  Bottom 0.203: U$5.47 147.96,41.66 146.81,40.51 144.65,40.51 143.57,41.59 140.27,41.59 v139.7,41.02 | v98.3,41.02 97.85,41.46 95.69,41.46 78.49,24.26 J2.2 77.22,21.72 77.22,11.98 U$12.4
CAN_L  (via drill 0.35)
  Top 0.203: v139.57,42.16 139.32,41.91 98.55,41.91 v98.3,42.16
  Bottom 0.203: U$12.5 76.71,13.51 76.71,22.23 J2.1 76.33,22.99 95.5,42.16 v98.3,42.16 | v139.57,42.16 145.29,42.16 U$5.48
FB
  Top 0.508: U1.6 69.81,52.03 R6.2 72.77,53.81 R7.1
GND  (via drill 0.35, 0.65, 0.9)
  Top 0.305: C7.2 72.23,48.68 71.88,49.02
  Top 1.524: J4.1 34.33,6.86 J4.2 | J5.2 24,10.79 J5.1
  Bottom 1.524: 7.37,18.67 10.16,18.67 J3.1 12.99,16.76 J3.2 | J5.1 22.35,12.45 | J5.1 v18.41,16.38 | v33.4,11.43 J4.1 34.33,6.86 J4.2 | J5.1 23.66,12.07 J5.2
  other vias: 120.9,49.66 123.44,49.66 125.98,49.66 128.52,49.66 131.06,49.66 117.86,37.21 120.9,37.21 123.7,37.21 126.49,37.21 129.29,37.21 110.74,63.63 127.13,17.65 136.91,19.43 115.32,87.25 109.22,83.44 110.49,82.17 114.05,88.52 79.25,68.96 115.82,69.47 106.43,58.8 100.84,52.7 51.18,68.07 44.2,75.56 45.97,73.53 44.2,78.87 31.24,78.87 70.99,64.77 91.44,73.53 4.83,36.45 6.73,17.78 7.24,38.23 22.61,79.63 35.31,78.87 25.15,78.87 41.4,78.87 28.7,78.87 38.86,78.87 98.3,64.9 119.89,82.68 118.62,72.77 6.22,24.77 2.29,38.35 111,3.17 109.22,35.69 134.11,15.75 101.09,27.81 105.41,32.13 53.34,73.28 61.72,74.29 63.25,73.79 62.48,75.56 69.09,85.72 68.83,88.01 53.09,90.04 50.29,90.04 51.56,91.57 53.34,91.82 71.37,89.53 114.05,53.47 116.33,55.5 119.13,58.55 111.51,50.93 114.55,3.43 75.18,20.07 75.18,14.73 78.36,14.61 78.36,20.07 83.31,26.67 95.89,39.12 88.65,31.5 91.57,40.26 85.85,34.8 80.39,29.21 101.35,43.18 101.09,39.75 107.7,40.13 107.95,43.18 116.84,43.18 126.49,43.18 133.22,43.18 19.18,15.62 33.4,10.41 75.44,51.69 69.47,55.24 67.56,49.66
  pour Top: 143.64,59.05 143.64,48.77 149.73,48.77 149.73,59.05
  pour Top (isolate 0.508, rank 6): -1.98,100.46 -1.98,-6.43 155.98,-6.43 155.98,100.46
  pour Bottom (isolate 0.762, rank 6): -2.29,98.68 -2.29,-8.51 -2.03,-8.76 154.81,-8.76 154.81,98.43 -2.03,98.43
N$4
  Top 0.457: R5.1 19.12,77.81 D2.A
N$5
  Top 0.762: R3.1 132.3,76.81 D3.A
N$6
  Top 0.762: R1.1 108.52,92.9 107.94,92.32 D4.A
N$8
  Top 0.508: R2.1 146.7,22.45 D1.A
N$10
  Top 1.016: U$13.2 R4.2
SW_5  (via drill 0.35)  (1 unrouted)
  Top 0.254: v71.63,45.59 U1.1
  Top 1.778: U1.1 arc0 69.72,41.27 | 69.72,41.27 69.72,38.35 72.39,35.69 | 69.72,41.27 70.45,42 L1.1
  Bottom 0.254: C6.2 71,46.22 v71.63,45.59
SW_5_3  (via drill 0.35)  (1 unrouted)
  Top 0.254: v57.66,80.65 57.66,78.87 U2.1
  Top 1.27: 50.8,79.12 51.23,78.69 51.26,78.72
  Top 1.778: 51.23,78.69 arc0 U2.1 | L2.1 51.26,72.15 U$3.P$4
  Bottom 0.254: C20.2 57.66,78.78 v57.66,80.65
X
  cutout Top: 76.71,51.18 88.14,51.18 88.14,43.81 76.71,43.81
  cutout Top: 57.91,61.34 57.91,72.77 65.28,72.77 65.28,61.34

### Text on the board
tNames: 5V | 3.3V | CAN_L - CAN_H | GND - 5V | GND - 5V | ROX X12.5 Power Conversion v2 / Erin Park / Ryan Pearson / Cynthia Zatlokowicz / Grant Geyer / 10/25/2020 | GND - 5V